# Altium project openmv-ae3-r3.PrjPcb (part 2 of 2)
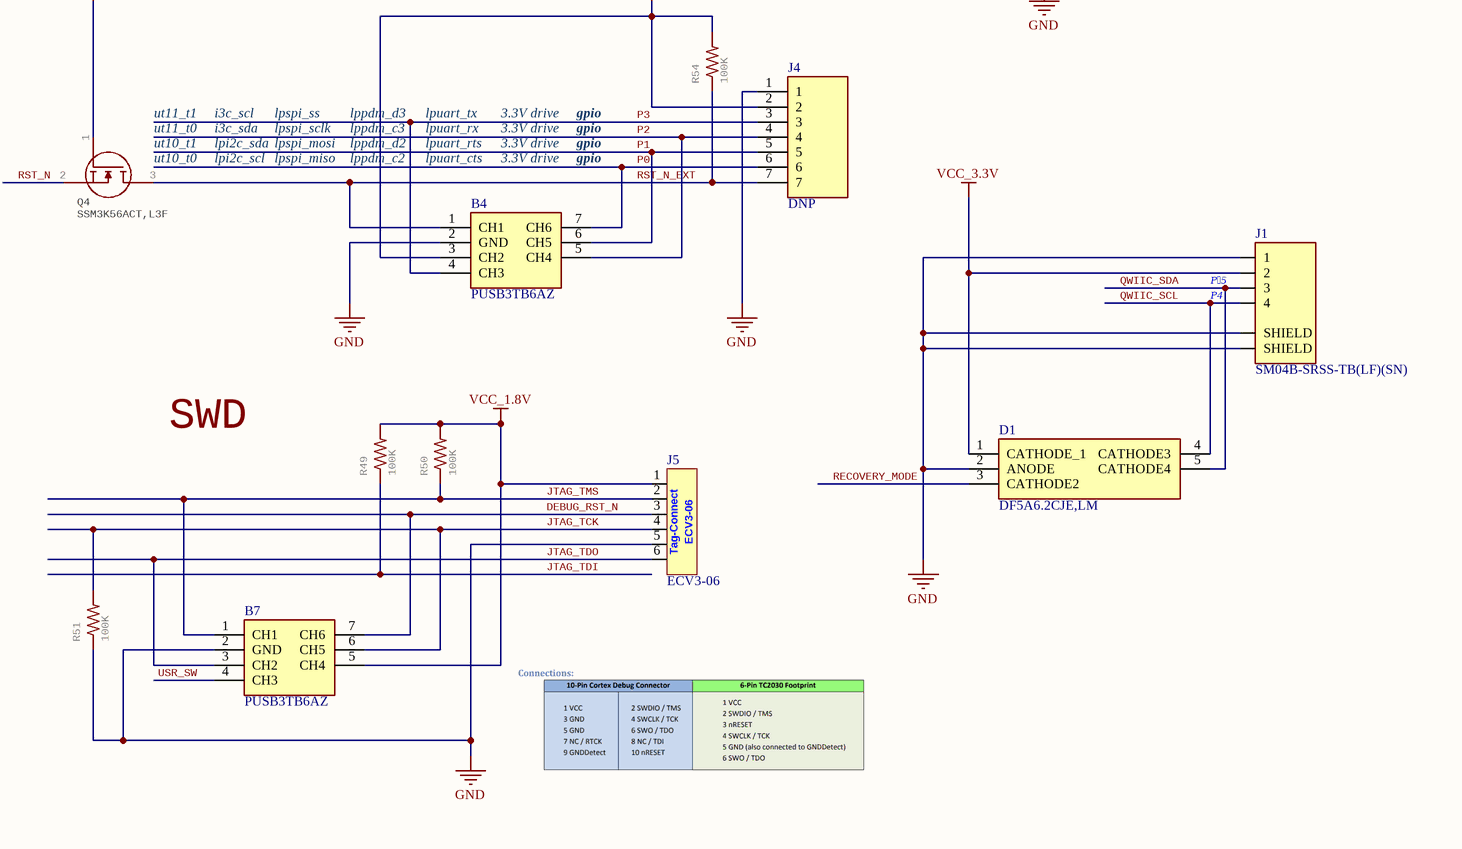
[diagram p12: processor.SchDoc, bottom right]

## Nets that join several sheets
GND: usb (33 pins), wifi-bt (28 pins), flash (8 pins), imu (5 pins), camera (37 pins), tof (12 pins), mic (6 pins), regulators (22 pins), processor (77 pins)
VBUS: usb (L7.2), regulators (B2.1 B2.6 C64.1), processor (U4.H14)
VCC_1.2V_CAM: camera (14 pins), regulators (C71.1 C73.2 L10.2 R24.2)
VCC_1.8V: usb (5 pins), wifi-bt (6 pins), flash (12 pins), imu (9 pins), mic (C76.1 C77.2 C120.2 IC3.5), regulators (6 pins), processor (27 pins)
VCC_1.8V_CAM: camera (10 pins), tof (7 pins), regulators (C10.2 U9.A1)
VCC_2.8V_CAM: camera (6 pins), tof (5 pins), regulators (C72.2 U8.1)
VCC_3.3V: usb (C54.1 C55.2 U5.9), wifi-bt (6 pins), regulators (10 pins), processor (26 pins)
VCC_3.3V_INT: usb (10 pins), regulators (6 pins)
BT_D_WAKE: wifi-bt (IC1.39), processor (U4.J27)
BT_H_WAKE: wifi-bt (IC1.38 R7.2), processor (U4.E1)
BT_REG_ON: wifi-bt (IC1.14), processor (U4.A9)
BT_UART_CTS_N: wifi-bt (IC1.5), processor (U4.D16)
BT_UART_RTS_N: wifi-bt (IC1.4), processor (U4.C17)
BT_UART_RX: wifi-bt (IC1.3), processor (U4.J5)
BT_UART_TX: wifi-bt (IC1.2), processor (U4.K2)
DCMI_CLK: camera (U1.C1), processor (U4.K20)
DCMI_D0: camera (U1.B5), processor (U4.C19)
DCMI_D1: camera (U1.D5), processor (U4.E19)
DCMI_D2: camera (U1.B2), processor (U4.B20)
DCMI_D3: camera (U1.A2), processor (U4.A21)
DCMI_D4: camera (U1.D3), processor (U4.D20)
DCMI_D5: camera (U1.C3), processor (U4.H28)
DCMI_D6: camera (U1.A3), processor (U4.H22)
DCMI_D7: camera (U1.B3), processor (U4.H20)
DCMI_GPIO0: camera (U1.E5), processor (U4.F2)
DCMI_GPIO1: camera (U1.E7), processor (U4.F6)
DCMI_HSYNC: camera (U1.A6), processor (U4.K26)
DCMI_PCLK: camera (U1.C4), processor (U4.K22)
DCMI_PWDN_N: regulators (B1.1 U8.3 U9.B2), processor (U4.E5)
DCMI_RST_N: camera (R5.2 U1.H3), processor (U4.A1)
DCMI_SCL: camera (R3.1 U1.D2), processor (U4.G21)
DCMI_SDA: camera (R4.1 U1.D1), processor (U4.G23)
DCMI_VSYNC: camera (U1.E4), processor (U4.K24)
FLASH_CS#: flash (R11.1 U2.C2), processor (U4.F22)
FLASH_D0: flash (U2.D3), processor (U4.G7)
FLASH_D1: flash (U2.D2), processor (U4.J3)
FLASH_D2: flash (U2.C4), processor (U4.J1)
FLASH_D3: flash (U2.D4), processor (U4.H4)
FLASH_D4: flash (U2.D5), processor (U4.G5)
FLASH_D5: flash (U2.E3), processor (U4.F12)
FLASH_D6: flash (U2.E2), processor (U4.H2)
FLASH_D7: flash (U2.E1), processor (U4.F10)
FLASH_DQSM: flash (U2.C3), processor (U4.G9)
FLASH_INT#: flash (R9.1 U2.A5), processor (U4.H6)
FLASH_RST#: flash (U2.A4), processor (U4.F20)
FLASH_SCLK_N: flash (U2.B1), processor (U4.G19)
FLASH_SCLK_P: flash (U2.B2), processor (U4.G17)
I2S_MIC_SCLK: mic (IC3.4), processor (U4.D10)
I2S_MIC_SDI: mic (IC3.6 R55.2), processor (U4.E3)
I2S_MIC_WS: mic (IC3.1), processor (U4.C9)
IMU_CS#: imu (R1.1 U7.12), processor (U4.R21)
IMU_INT1: imu (U7.4), processor (U4.R27)
IMU_INT2: imu (U7.9), processor (U4.J15)
IMU_MISO: imu (U7.1), processor (U4.N19)
IMU_MOSI: imu (U7.14), processor (U4.P20)
IMU_SCLK: imu (R2.1 U7.13), processor (U4.K16)
RECOVERY_MODE: usb (Q5.1 Q6.1 R56.2 S1.2), processor (D1.3)
RST_N: usb (Q6.3), processor (C37.2 Q4.2 R36.1 U4.D6)
SEUART_RX_INT: usb (B5.4), processor (R34.1 U4.B2)
SEUART_TX_INT: usb (B5.5), processor (R35.1 U4.C5)
TOF_I2C_GPIO: tof (IC2.C2 R28.1), processor (U4.J25)
TOF_I2C_INT: tof (IC2.A3 R26.1), processor (U4.L17)
TOF_I2C_LPN: tof (IC2.A5 R27.1), processor (U4.G25)
TOF_I2C_RST: tof (IC2.A1 IC2.A8 R31.2), processor (U4.J23)
TOF_I2C_SCL: tof (IC2.C4 R30.1), processor (U4.L3)
TOF_I2C_SDA: tof (IC2.C3 R29.1), processor (U4.L1)
USB_D_N: usb (U5.6), processor (U4.N15)
USB_D_P: usb (U5.7), processor (U4.R15)
USB_D_SEL: usb (R18.1), processor (U4.K18)
USB_D_SEL_FB: usb (Q5.3 R18.2 R19.2 U5.10), processor (U4.N23)
USR_SW: usb (Q6.2), processor (5 pins)
WIFI_GPIO_1: wifi-bt (IC1.18), processor (U4.A5)
WIFI_GPIO_2: wifi-bt (IC1.17), processor (U4.A7)
WIFI_I2S_SCLK: wifi-bt (IC1.11), processor (U4.C1)
WIFI_I2S_SDI: wifi-bt (IC1.10), processor (U4.D2)
WIFI_I2S_SDO: wifi-bt (IC1.9), processor (U4.D4)
WIFI_I2S_WS: wifi-bt (IC1.8), processor (U4.E7)
WIFI_IRQ: wifi-bt (IC1.26), processor (U4.K28)
WIFI_MISO: wifi-bt (IC1.24), processor (U4.A15)
WIFI_MOSI: wifi-bt (IC1.22), processor (U4.B16)
WIFI_SCLK: wifi-bt (IC1.20), processor (U4.F16)
WIFI_SSEL: wifi-bt (IC1.25 R13.2), processor (U4.E17)
WL_H_WAKE: wifi-bt (IC1.27 R6.1), processor (U4.M28)
WL_REG_ON: wifi-bt (IC1.28), processor (U4.L27)